# EAGLE design WT901 (EAGLE 9.6.2)
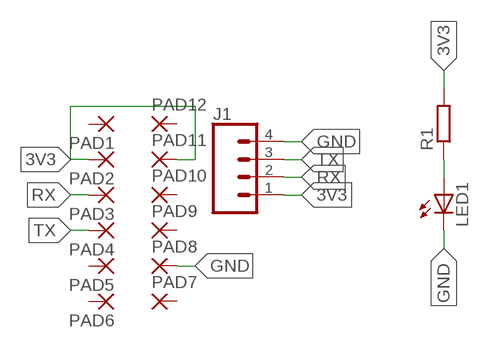
[diagram p0: schematic, sheet 1]

## Parts
J1  CONN_04JST-SMD  [JST-4-SMD]
LED1  LEDCHIPLED_0805  [CHIPLED_0805]
PAD1  SMD2  [SMD1,27-2,54]
PAD2  SMD2  [SMD1,27-2,54]
PAD3  SMD2  [SMD1,27-2,54]
PAD4  SMD2  [SMD1,27-2,54]
PAD5  SMD2  [SMD1,27-2,54]
PAD6  SMD2  [SMD1,27-2,54]
PAD7  SMD2  [SMD1,27-2,54]
PAD8  SMD2  [SMD1,27-2,54]
PAD9  SMD2  [SMD1,27-2,54]
PAD10  SMD2  [SMD1,27-2,54]
PAD11  SMD2  [SMD1,27-2,54]
PAD12  SMD2  [SMD1,27-2,54]
R1  R-EU_R0805  [R0805]

## Nets
3V3: J1.1 PAD2.1(P) PAD11.1(P) R1.2
GND: J1.4 LED1.C PAD8.1(P)
N$1: LED1.A R1.1
RX: J1.2 PAD3.1(P)
TX: J1.3 PAD4.1(P)
Unconnected: PAD1.1(P) PAD5.1(P) PAD6.1(P) PAD7.1(P) PAD9.1(P) PAD10.1(P) PAD12.1(P)

## Library data of the parts
J1 = SparkFun-Connectors:CONN_04: Multi connection point. Often used as Generic Header-pin footprint for 0.1 inch spaced/style header connections On any of the 0.1 inch spaced packages, you can populate with these: Break Away Headers - Straight <https://www.sparkfun.com/products/116> (PRT-00116) Break Away Male Headers - Right Angle <https://www.sparkfun.com/products/553> (PRT-00553) Female Headers <https://www.sparkfun.com/products/115> (PRT-00115) Break Away Headers - Machine Pin <https://www.sparkfun.com/products/117> (PRT-00117) Break Away Female Headers - Swiss Machine Pin <https://www.sparkfun.com/products/743> (PRT-00743) For SCREWTERMINALS and SPRING TERMINALS visit here: Screw Terimnals on SparkFun.com <https://www.sparkfun.com/search/results?term=Screw+Terminals> (5mm/3.5mm/2.54mm spacing) This device is also useful as a general connection point to wire up your design to another part of your project. Our various solder wires solder well into these plated through hole pads. Hook-Up Wire - Assortment (Stranded, 22 AWG) <https://www.sparkfun.com/products/11375> (PRT-11375) Hook-Up Wire - Assortment (Solid Core, 22 AWG) <https://www.sparkfun.com/products/11367> (PRT-11367) View the entire wire category on our website here <https://www.sparkfun.com/categories/141> Special notes: Molex polarized connector foot print use with SKU : PRT-08231 with associated crimp pins and housings. 1MM SMD Version SKU: PRT-10208
LED1 = adafruit:LED: LED OSRAM: - CHIPLED LG R971, LG N971, LY N971, LG Q971, LY Q971, LO R971, LY R971 LH N974, LH R974 LS Q976, LO Q976, LY Q976 LO Q996 - Hyper CHIPLED LW Q18S LB Q993, LB Q99A, LB R99A - SideLED LS A670, LO A670, LY A670, LG A670, LP A670 LB A673, LV A673, LT A673, LW A673 LH A674 LY A675 LS A676, LA A676, LO A676, LY A676, LW A676 LS A679, LY A679, LG A679 - Hyper Micro SIDELED® LS Y876, LA Y876, LO Y876, LY Y876 LT Y87S - SmartLED LW L88C, LW L88S LB L89C, LB L89S, LG L890 LS L89K, LO L89K, LY L89K LS L896, LA L896, LO L896, LY L896 - TOPLED LS T670, LO T670, LY T670, LG T670, LP T670 LSG T670, LSP T670, LSY T670, LOP T670, LYG T670 LG T671, LOG T671, LSG T671 LB T673, LV T673, LT T673, LW T673 LH T674 LS T676, LA T676, LO T676, LY T676, LB T676, LH T676, LSB T676, LW T676 LB T67C, LV T67C, LT T67C, LS T67K, LO T67K, LY T67K, LW E67C LS E67B, LA E67B, LO E67B, LY E67B, LB E67C, LV E67C, LT E67C LW T67C LS T679, LY T679, LG T679 LS T770, LO T770, LY T770, LG T770, LP T770 LB T773, LV T773, LT T773, LW T773 LH T774 LS E675, LA E675, LY E675, LS T675 LS T776, LA T776, LO T776, LY T776, LB T776 LHGB T686 LT T68C, LB T68C - Hyper Mini TOPLED® LB M676 - Mini TOPLED Santana® LG M470 LS M47K, LO M47K, LY M47K Source: http://www.osram.convergy.de/
PAD1-PAD12 = wirepad:SMD2: SMD PAD
R1 = Clean-Kong:R-EU_: RESISTOR, European symbol

## Board
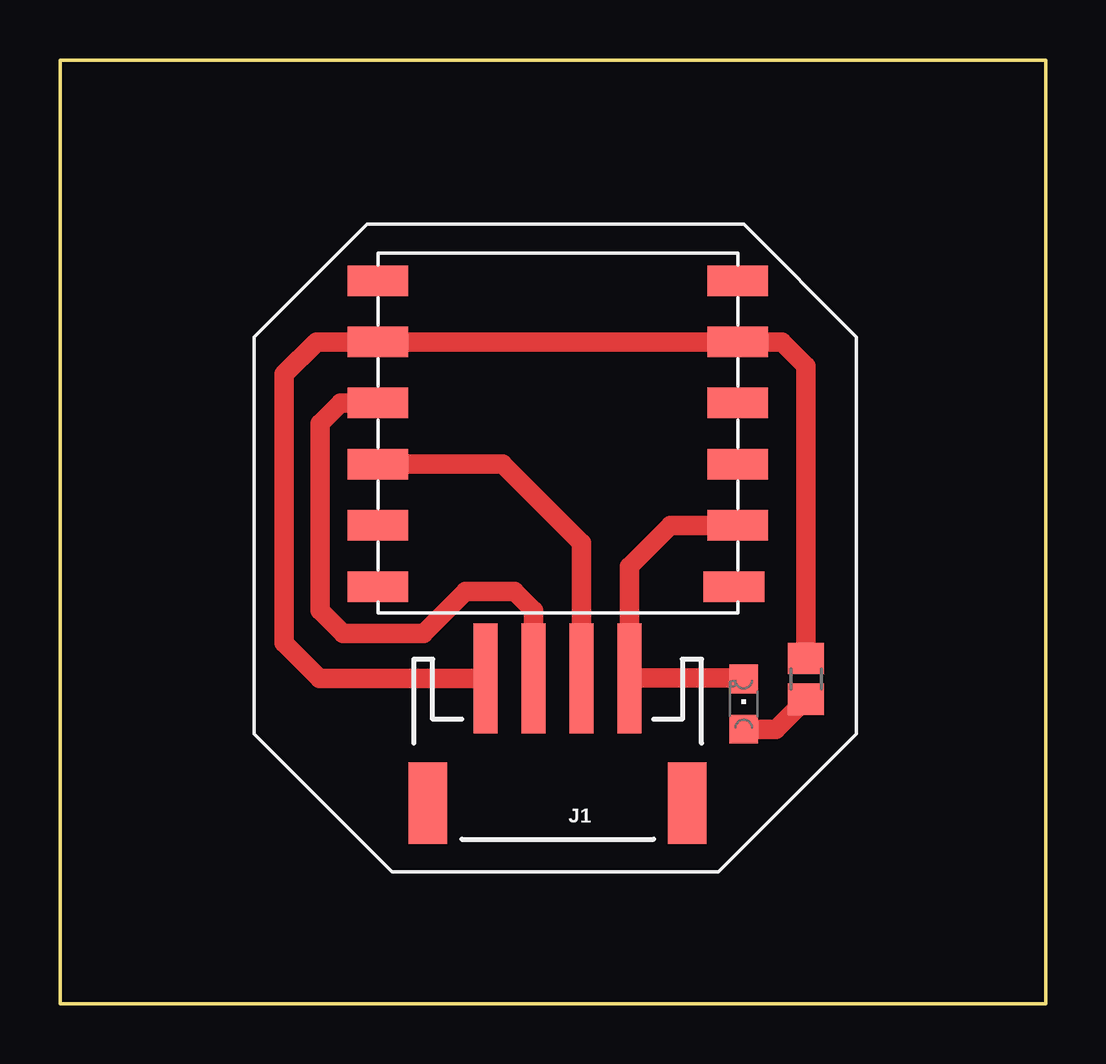
[diagram p1: board, top side]

Size 41.1 x 39.35 mm. Coordinates in mm from the lower left corner, seen from the top.
Outline: 0,39.35 41.1,39.35 41.1,0 0,0 0,39.35
Copper layers (1*16): Top 0.035mm / dielectric 1.5mm / Bottom 0.035mm
Design rules "default": minimum track width 6mil, minimum drill 0.35mm, track to track 6mil, track to pad 6mil, pad to pad 6mil, via to via 6mil, smd to smd 6mil, copper to edge 40mil, drill to drill 6mil, minimum pad ring 10mil, minimum via ring 8mil, stop-mask expansion 4mil, vias tented up to drill 0mil, thermal gap 10mil

### Footprints (pad centres in the part's own frame; a part is rotated, then mirrored left to right if it is on the bottom)
JST-4-SMD = smd 1 x 4.6: 1 3.01,-4.77; 2 1.01,-4.77; 3 -0.99,-4.77; 4 -2.99,-4.77 | smd 1.6 x 3.4: NC1 -5.39,0.43; NC2 5.41,0.43
CHIPLED_0805 = smd 1.2 x 1.2: A 0,-1.05; C 0,1.05
SMD1,27-2,54 = smd 1.27 x 2.54: 1 0,0
R0805 = smd 1.3 x 1.5: 1 -0.85,0; 2 0.85,0

### Placement (x,y rotation side)
J1  20.75,8.8 180 top
LED1  28.5,12.5 0 top
PAD1  13.25,30.15 90 top
PAD2  13.25,27.6 90 top
PAD3  13.25,25.05 90 top
PAD4  13.25,22.5 90 top
PAD5  13.25,19.95 90 top
PAD6  13.25,17.4 90 top
PAD7  28.1,17.4 90 top
PAD8  28.25,19.95 90 top
PAD9  28.25,22.5 90 top
PAD10  28.25,25.05 90 top
PAD11  28.25,27.6 90 top
PAD12  28.25,30.15 90 top
R1  31.1,13.55 90 top

### Tracks (layer width: path | path; a pad name or v marks a point on that pad's centre or on a via)
3V3
  Top 0.813: J1.1 10.83,13.57 9.35,15.05 9.35,26.25 10.7,27.6 PAD2.1 PAD11.1 30.1,27.6 31.1,26.6 R1.2
GND
  Top 0.813: 23.74,13.65 23.74,18.24 25.45,19.95 PAD8.1 | 23.74,13.65 J1.4 | LED1.C 28.45,13.6 23.79,13.6 23.74,13.65
N$1
  Top 0.813: LED1.A 29.85,11.45 R1.1
RX
  Top 0.813: PAD3.1 11.7,25.05 10.85,24.2 10.85,16.4 11.8,15.45 15.15,15.45 16.9,17.2 18.95,17.2 19.74,16.41 J1.2
TX
  Top 0.813: J1.3 21.74,19.21 18.45,22.5 PAD4.1